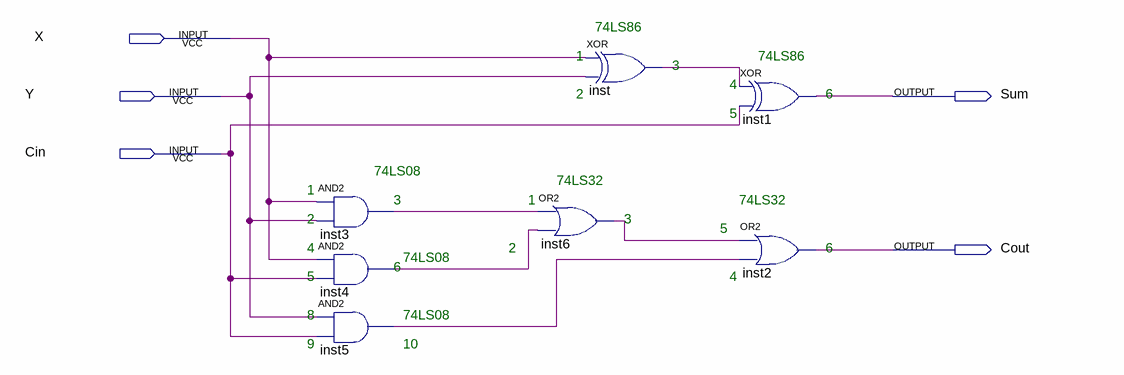
[diagram p0: schematic sheet]
// Quartus schematic Lab6.bdf as structural Verilog: 7 symbols, 5 pins
module Lab6 (
  input  X,
  input  Y,
  input  Cin,
  output Sum,
  output Cout
);

  wire inst3_out, inst4_out, inst5_out, inst6_out, inst_out;

  and inst3 (inst3_out, X, Y);
  and inst4 (inst4_out, X, Cin);
  and inst5 (inst5_out, Y, Cin);
  xor inst (inst_out, X, Y);
  or inst6 (inst6_out, inst3_out, inst4_out);
  xor inst1 (Sum, inst_out, Cin);
  or inst2 (Cout, inst6_out, inst5_out);

  // Notes on the sheet:
  //   74LS86
  //   1
  //   74LS86
  //   3
  //   4
  //   2
  //   6
  //   5
  //   74LS08
  //   74LS32
  //   1
  //   3
  //   1
  //   74LS32
  //   2
  //   3
  //   5
  //   4
  //   2
  //   6
  //   74LS08
  //   6
  //   5
  //   4
  //   8
  //   74LS08
  //   9
  //   10
endmodule
